# Altium project Arduino_Nano.PrjPcb
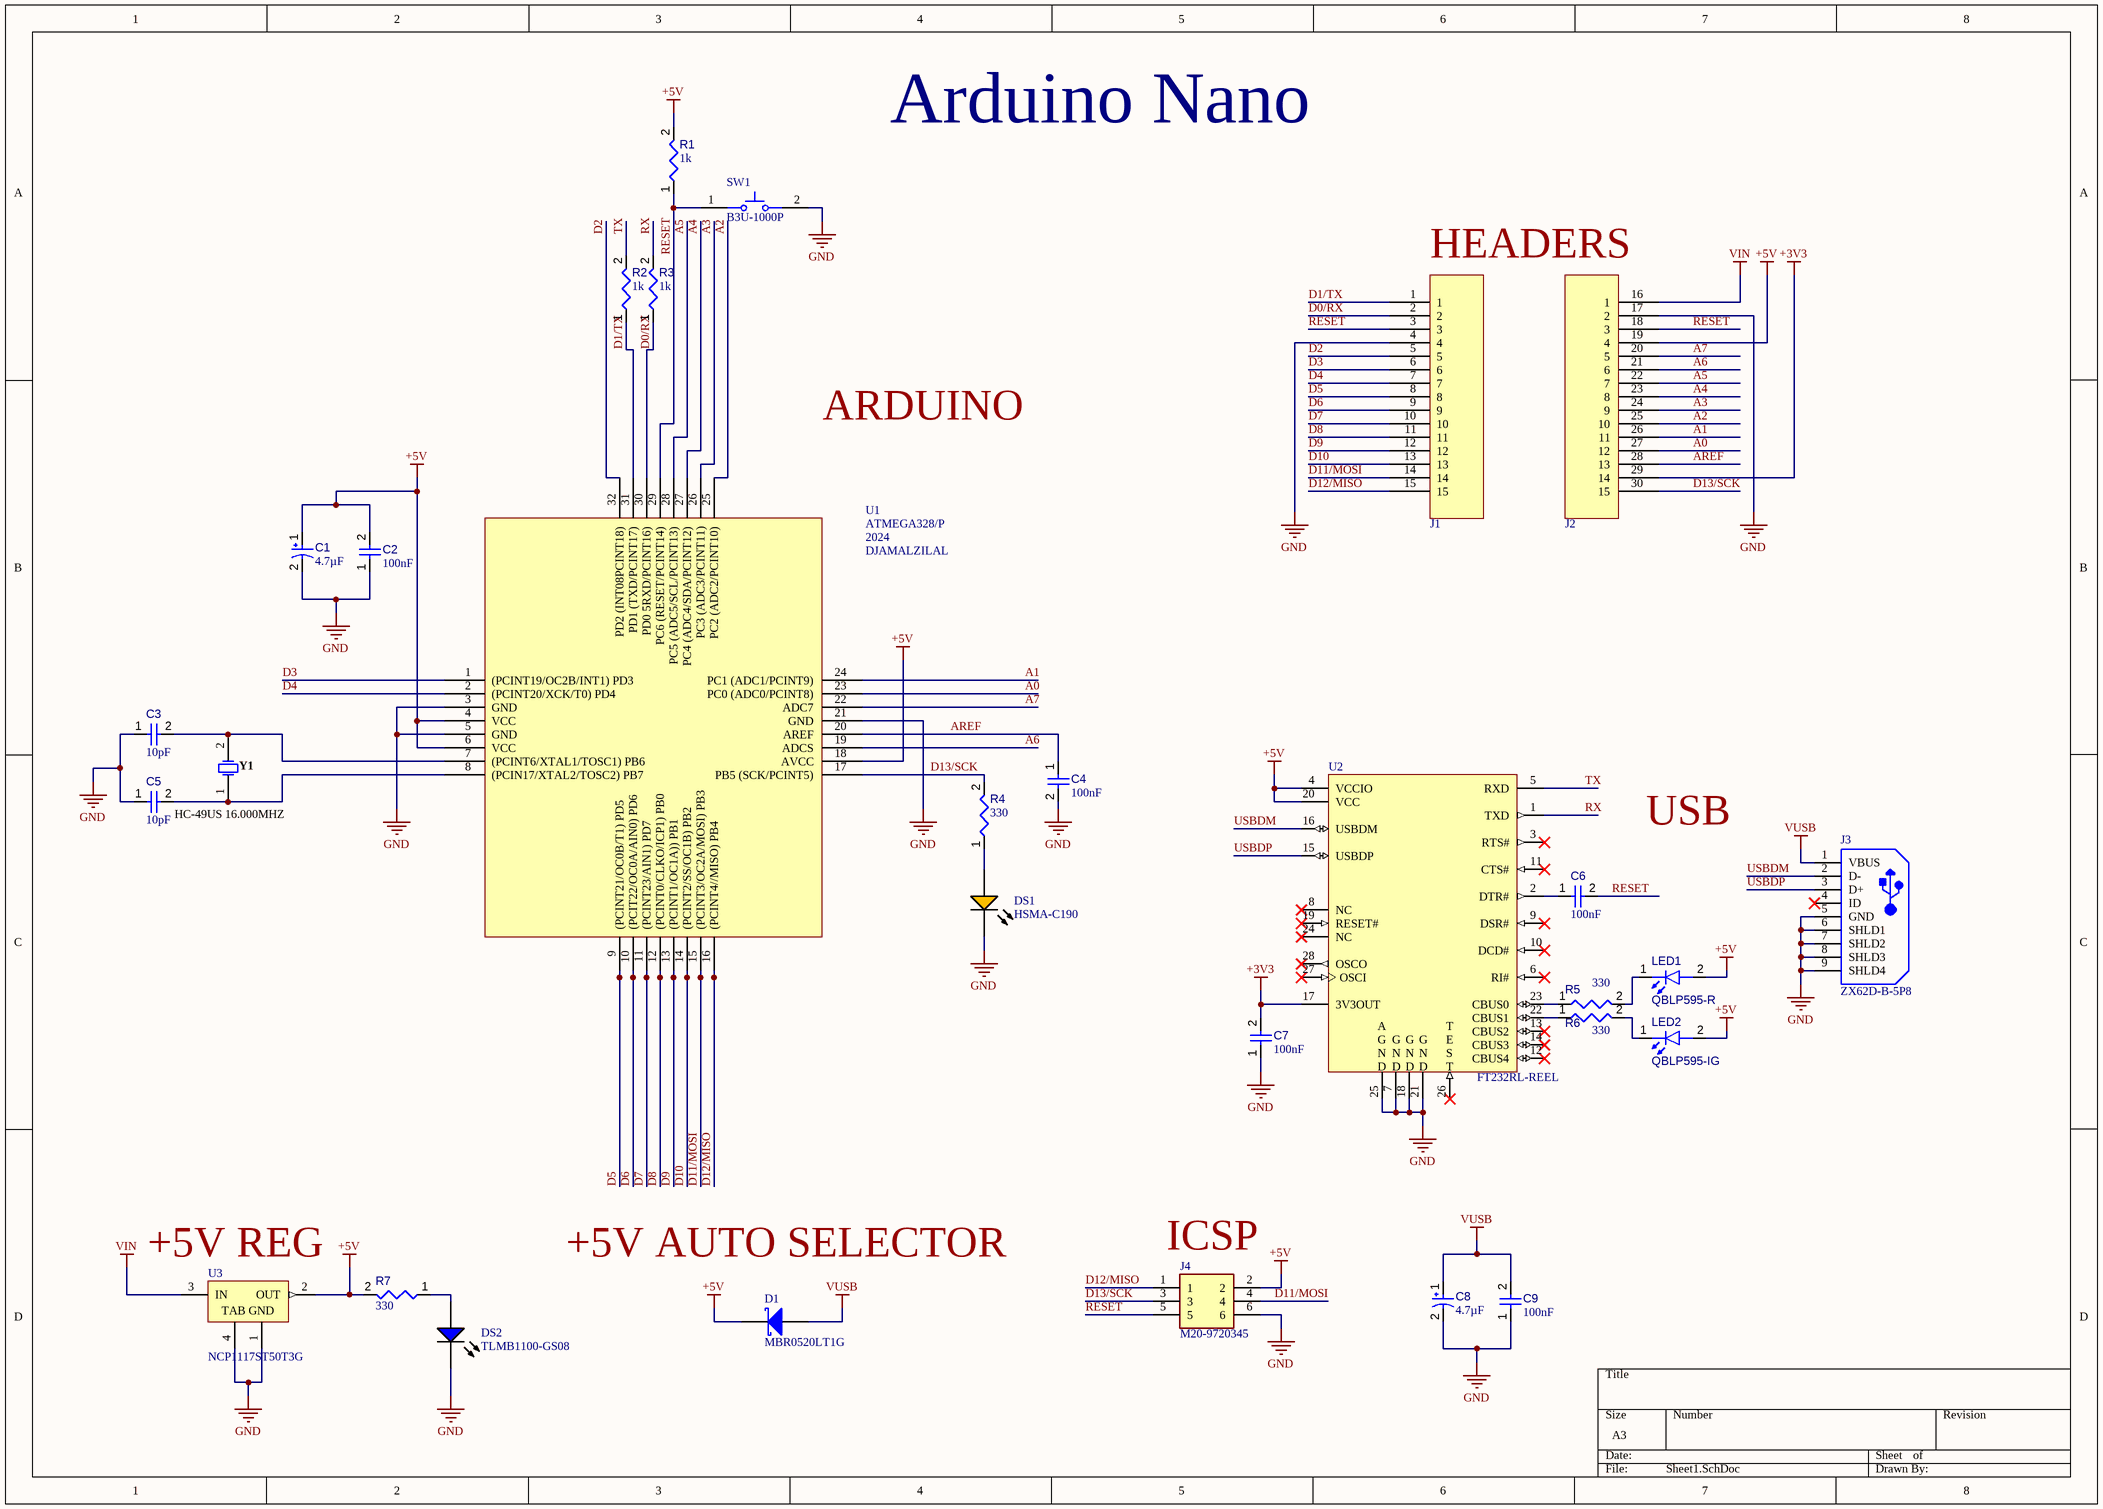
[diagram p0: Sheet1.SchDoc]
1 sheet, 30 parts. Net scope: global (net labels, ports and power ports of the same name join across sheets).
Board file: PCB1.PcbDoc

## Sheet Sheet1.SchDoc: ARDUINO NANO
size A3; Date: 03/03/2024; DrawnBy: ALTIUM DESIGNER; Engineer: DJAMAL ZILAL; Revision: REV01; SheetNumber: 1; SheetTotal: 1; Time: 14:40

### Parts
C1  value 4.7µF  [CAPPR55-200-1100X500X1200]  (hidden comment: ECA1HM4R7)
C2  value 100nF  [CAPC1005X56X25LL10T15]  (hidden comment: Capacitor 0.1 uF +/- 5% 16 V 0402)
C3  value 10pF  [CAPC1005X55X30LL05T10]  (hidden comment: Capacitor 10 pF +/- 0.25 pF 50 V 0402)
C4  value 100nF  [CAPC1005X56X25LL10T15]  (hidden comment: Capacitor 0.1 uF +/- 5% 16 V 0402)
C5  value 10pF  [CAPC1005X55X30LL05T10]  (hidden comment: Capacitor 10 pF +/- 0.25 pF 50 V 0402)
C6  value 100nF  [CAPC1005X56X25LL10T15]  (hidden comment: Capacitor 0.1 uF +/- 5% 16 V 0402)
C7  value 100nF  [CAPC1005X56X25LL10T15]  (hidden comment: Capacitor 0.1 uF +/- 5% 16 V 0402)
C8  value 4.7µF  [CAPPR55-200-1100X500X1200]  (hidden comment: ECA1HM4R7)
C9  value 100nF  [CAPC1005X56X25LL10T15]  (hidden comment: Capacitor 0.1 uF +/- 5% 16 V 0402)
D1  MBR0520LT1G  [ONSC-SOD-123-2-425-04_V]
DS1  HSMA-C190  [AVAG-HSMX-C190_V]
DS2  TLMB1100-GS08  [VISH-TLMX1100-2_V]
J1  both parts are inseparated  [PCBComponent_1]  (value not drawn)
J2  both parts are inseparated  [PCBComponent_1]  (value not drawn)
J3  ZX62D-B-5P8  [HIRO-ZX62D-B-5P8_V]
J4  M20-9720345  [HDRV6W64P254_2X3_762X508X864P]
LED1  QBLP595-R  [QTB-QBLP595_V]
LED2  QBLP595-IG  [QTB-QBLP595_V]
R1  value 1k  [RESC0402(1005)_L]  (hidden comment: 1KR2J)
R2  value 1k  [RESC0402(1005)_L]  (hidden comment: 1KR2J)
R3  value 1k  [RESC0402(1005)_L]  (hidden comment: 1KR2J)
R4  value 330  [RESC0402(1005)_L]  (hidden comment: 330R2J)
R5  value 330  [RESC0402(1005)_L]  (hidden comment: 330R2J)
R6  value 330  [RESC0402(1005)_L]  (hidden comment: 330R2J)
R7  value 330  [RESC0402(1005)_L]  (hidden comment: 330R2J)
SW1  B3U-1000P  [OMRON-B3U-1000_V]
U1  ATMEGA328/P  DATA CREATED: 2024  CREATED By: DJAMALZILAL  [ATMEGA328/P]
U2  FT232RL-REEL  [FTDI-SSOP-28_M]
U3  NCP1117ST50T3G  [ONSC-SOT-223-4-318H-01_A_V]
Y1  HC-49US 16.000MHZ  [JPY-HC-49US]

### Nets
+3V3: C7.2 J2.29(14) U2.17(3V3OUT)
+5V: C1.1 C2.2 D1.2(K) J2.19(4) J4.2 LED1.2(A) LED2.2(A) R1.2 R7.2 U1.4(VCC) U1.6(VCC) U1.18(AVCC) U2.4(VCCIO) U2.20(VCC) U3.2(OUT)
GND: C1.2 C2.1 C3.1 C4.2 C5.1 C7.1 C8.2 C9.1 DS1.2(K) DS2.2(K) J1.4 J2.17(2) J3.5(GND) J3.6(SHLD1) J3.7(SHLD2) J3.8(SHLD3) J3.9(SHLD4) J4.6 SW1.2 U1.3(GND) U1.5(GND) U1.21(GND) U2.7(GND) U2.18(GND) U2.21(GND) U2.25(AGND) U3.1(GND) U3.4(TAB)
VIN: J2.16(1) U3.3(IN)
VUSB: C8.1 C9.2 D1.1(A) J3.1(VBUS)
A0: J2.27(12) U1.23(PC0_(ADC0/PCINT8))
A1: J2.26(11) U1.24(PC1_(ADC1/PCINT9))
A2: J2.25(10) U1.25(PC2_(ADC2/PCINT10))
A3: J2.24(9) U1.26(PC3_(ADC3/PCINT11))
A4: J2.23(8) U1.27(PC4_(ADC4/SDA/PCINT12))
A5: J2.22(7) U1.28(PC5_(ADC5/SCL/PCINT13))
A6: J2.21(6) U1.19(ADCS)
A7: J2.20(5) U1.22(ADC7)
AREF: C4.1 J2.28(13) U1.20(AREF)
D0/RX: J1.2 R3.1 U1.30(PD0_5RXD/PCINT16))
D1/TX: J1.1 R2.1 U1.31(PD1_(TXD/PCINT17))
D2: J1.5 U1.32(PD2_(INT08PCINT18))
D3: J1.6 U1.1((PCINT19/OC2B/INT1)_PD3)
D4: J1.7 U1.2((PCINT20/XCK/T0)_PD4)
D5: J1.8 U1.9((PCINT21/OC0B/T1)_PD5)
D6: J1.9 U1.10((PCIT22/OC0A/AIN0)_PD6)
D7: J1.10 U1.11((PCINT23/AIN1)_PD7)
D8: J1.11 U1.12((PCINT0/CLKO/ICP1)_PB0)
D9: J1.12 U1.13((PCINT1/OC1A))_PB1)
D10: J1.13 U1.14((PCINT2/SS/OC1B)_PB2)
D11/MOSI: J1.14 J4.4 U1.15((PCINT3/OC2A/MOSI)_PB3)
D12/MISO: J1.15 J4.1 U1.16((PCINT4//MISO)_PB4)
D13/SCK: J2.30(15) J4.3 R4.2 U1.17(PB5_(SCK/PCINT5))
RESET: C6.2 J1.3 J2.18(3) J4.5 R1.1 SW1.1 U1.29(PC6_(RESET/PCINT14))
RX: R3.2 U2.1(TXD)
TX: R2.2 U2.5(RXD)
USBDM: J3.2(D-) U2.16(USBDM)
USBDP: J3.3(D+) U2.15(USBDP)
NetC3_2: C3.2 U1.7((PCINT6/XTAL1/TOSC1)_PB6) Y1.2
NetC5_2: C5.2 U1.8((PCIN17/XTAL2/TOSC2)_PB7) Y1.1
NetC6_1: C6.1 U2.2(DTR#)
NetDS1_1: DS1.1(A) R4.1
NetDS2_1: DS2.1(A) R7.1
NetLED1_1: LED1.1(K) R5.2
NetLED2_1: LED2.1(K) R6.2
NetR5_1: R5.1 U2.23(CBUS0)
NetR6_1: R6.1 U2.22(CBUS1)

Not connected (* = marked no-connect by the designer): J3 4(ID)*; U2 3(RTS#)* 6(RI#)* 8(NC)* 9(DSR#)* 10(DCD#)* 11(CTS#)* 12(CBUS4)* 13(CBUS2)* 14(CBUS3)* 19(RESET#)* 24(NC)* 26(TEST)* 27(OSCI)* 28(OSCO)*

### Notes on the sheet
- Arduino Nano
- HEADERS
- ARDUINO
- USB
- (near U3) +5V REG
- +5V AUTO SELECTOR
- (near J4) ICSP
- (in symbol CMP-015-00000-2) A / G / N / D; G / N / D; T / E / S / T

### Library data of the parts
C1 C8 = CMP-001-00033-7: Aluminum Electrolytic Capacitor, 4.7 uF, +/- 20%, 50 V, -40 to 85 degC, 2-Pin THD, RoHS, Bulk; Manufacturer: Panasonic; Ripple Current (AC): 45mA; Voltage Rating: 50V; Diameter: 5mm; Min Operating Temperature: -40°C; Lead Pitch: 2mm; Package Quantity: 200; Capacitor Type: Electrolytic; Ripple Current: 45mA; Datasheet Version: Rev. 05, 10/2016; Case/Package: Radial; Pins: 2; Manufacturer URL: http://www.panasonic.com/; RoHS Compliant: True; Package Description: 2-Pin Radial Lead, Dia 5 mm, Height 12 mm; Packaging: Bulk; Datasheet URL: https://industrial.panasonic.com/cdbs/www-data/pdf/RDF0000/ABA0000C1218.pdf; Mounting Technology: TH; Max Operating Temperature: 85°C; Package Reference: CAPPR55-200-1100X500X1200; Tolerance: 20%
C2 C4 C6 C7 C9 = CMP-001-00001-6: Chip Capacitor, 0.1 uF, +/- 5%, 16 V, 0402 (1005 Metric); Capacitor Type: Ceramic; Voltage Rating: 16V; Max Operating Temperature: 125°C; Min Operating Temperature: -55°C; Case/Package: 0402; Mounting Technology: SM; Pins: 2; Tolerance: 5%; RoHS Compliant: True
C3 C5 = CMP-001-00011-6: Chip Capacitor, 10 pF, +/- 0.25 pF, 50 V, 0402 (1005 Metric); Voltage Rating: 50V; Tolerance: 0.25%; Capacitor Type: Ceramic; Mounting Technology: SM; Pins: 2; Case/Package: 0402; Min Operating Temperature: -55°C; RoHS Compliant: True; Max Operating Temperature: 125°C
D1 = CMP-004-00003-2: Schottky Power Rectifier, 20 V, 5.5 A, -65 to 125 degC, 2-Pin SMD, RoHS, Tape and Reel; Manufacturer: ON Semiconductor; Forward Current: 500mA; Peak Reverse Current: 250uA; Elements: 1; Forward Voltage: 385mV; Max Surge Current: 5.5A; Max Operating Temperature: 125°C; Min Operating Temperature: -65°C; Mounting Technology: SM; Datasheet URL: http://www.onsemi.cn/pub_link/Collateral/MBR0520LT1-D.PDF; RoHS Compliant: True; Pins: 2; Package Quantity: 3000; Case/Package: SOD; Package Reference: SOD-123-2-425-04; Package Description: 2-Pin Surface Mount Device, Body 2.69 x 1.6 mm; Packaging: TapeandReel; Manufacturer URL: http://www.onsemi.com/; Datasheet Version: Rev. 6, 01/2012
DS1 = CMP-007-00011-2: LED Uni-Color Amber, 60 mW, 20 mA, -40 to 85 degC, 2-Pin SMD, RoHS, Tape and Reel; Manufacturer: Avago; Forward Current: 20mA; Colour: Orange; Luminous Intensity: 90mcd; Lens Style: Diffused; Power: 60mW; Nominal Vf: 1.9V; Viewing Angle: 170degrees; Datasheet Version: Sep-10; Mounting Technology: SM; Case/Package: 0603; RoHS Compliant: True; Pins: 2; Packaging: TapeandReel; Package Reference: HSMX-C190; Manufacturer URL: http://www.avagotech.com/; Package Quantity: 4000; Min Operating Temperature: -40°C; Datasheet URL: http://docs.avagotech.com/docs/AV02-0112EN; Max Operating Temperature: 85°C; Forward Voltage: 1.9V; Package Description: 2-Pin Surface Mount Device, Body 1.6 x 0.8 mm, Height 0.9 mm; Illumination Colour: Orange
DS2 = CMP-007-00028-2: Blue LED, 10 mA, 3.9 V, -40 to 100 degC, 2-Pin SMD (0603), RoHS, Tape and Reel; Manufacturer: Vishay Semiconductor; Forward Voltage: 3.9V; Viewing Angle: 160degrees; Power: 68mW; Forward Current: 10mA; Lens Style: Diffused; Luminous Intensity: 5mcd; Case/Package: 0603; Datasheet URL: http://download.siliconexpert.com/pdfs/2016/8/7/12/43/26/667/vsh_/manual/379263299541529tlmb1100.pdf; Illumination Colour: Blue; Datasheet Version: Rev. 2.7, 03/2016; Manufacturer URL: http://www.vishay.com/; Package Reference: 0603; Min Operating Temperature: -40°C; Packaging: TapeandReel; RoHS Compliant: True; Nominal Vf: 3.9V; Mounting Technology: SM; Pins: 2; Package Description: 2-Pin Surface Mount Device, Body 1.6 x 0.8 mm; Colour: Blue; Package Quantity: 3000; Max Operating Temperature: 100°C
J1 J2 = Header 15
J3 = CMP-002-00043-2: Right Angle Receptacle Connector, Micro USB, 5 Position, Height 2.65 mm, -30 to 85 degC, RoHS, Tape and Reel; Manufacturer: Hirose Electric; Gender: Male; Rows: 1; Current Rating: 1A; Max Operating Temperature: 85°C; Package Quantity: 2000; Connector Type: USB; Datasheet Version: Aug-16; Contact Material: Copper; Packaging: TapeandReel; Package URL: https://www.hirose.com/product/en/download_file/key_name/ZX62D-B-5P8/category/Drawing%20(2D)/doc_file_id/36535/?file_category_id=6&item_id=02420034000&is_series=; Min Operating Temperature: -30°C; Case/Package: ZX62D-B-5P8; Package Reference: ZX62D-B-5P8; Pins: 5; Mounting Technology: SM; Package Description: USB Connector, 5 Position Surface Mount, Length 8 mm, Height 2.65 mm; Housing Material: Plastic; Datasheet URL: https://www.hirose.com/product/en/download_file/key_name/ZX62D-B-5P8/category/Catalog/doc_file_id/31704/?file_category_id=5&item_id=02420034000&is_series=; Contact Plating: Gold; Lead Pitch: 0.65mm; RoHS Compliant: True; Manufacturer URL: https://www.hirose.com
J4 = M20-9720345: Connector; Manufacturer_Name: Harwin; Datasheet Link: https://cdn.harwin.com/pdfs/M20-972.pdf; Height: 8.64mm; Manufacturer_Part_Number: M20-9720345; Mouser Part Number: 855-M20-9720345; Mouser Price/Stock: https://www.mouser.co.uk/ProductDetail/Harwin/M20-9720345?qs=vF78I%252BjhbY8b2N4EUBH%2Fyg%3D%3D
LED1 = CMP-007-00040-3: Chip LED 0402, Red, 0.02 A, 2.0 to 2.5 V, -40 to 80 degC, 2-Pin SMD, RoHS, Tape and Reel; Colour: Red; RoHS Compliant: Yes; Case/Package: 0402; Pins: 2; Mounting Technology: SMT
LED2 = CMP-007-00041-3: Chip LED 0402, Green, 0.02 A, 3.1 to 3.7 V, -40 to 80 degC, 2-Pin SMD, RoHS, Tape and Reel; Case/Package: 0402; Colour: Green; Mounting Technology: SMT; Pins: 2; RoHS Compliant: Yes
R1-R3 = CMP-009-00075-2: 1K 0.063W 5% 0402 (1005 Metric)  SMD; Power: 63mW; Pins: 2; Mounting Technology: SMT; Case/Package: 0402; Tolerance: 5%
R4-R7 = CMP-009-00095-2: 330R 0.063W 5% 0402 (1005 Metric)  SMD; Power: 63mW; Tolerance: 5%; Mounting Technology: SMT; Case/Package: 0402; Pins: 2
SW1 = CMP-011-00000-2: Tactile Switch, SPST-NO, 0.05 A, 12 V, -25 to 70 degC, 2-Pin SMD, RoHS, Tape and Reel; Manufacturer: Omron Electronic Components; IP Rating: IP40; Current Rating: 50mA; Max Contact Resistance: 100mohm; Operating Force: 153gf; Throw Configuration: SPST; Resistance: 0.1Ohm; Max Voltage Rating (DC): 12V; Contact Material: Silver; Max Current Rating: 50mA; Datasheet URL: http://www.omron.com/ecb/products/pdf/en-b3u.pdf; Mounting Technology: SM; Case/Package: B3U-1000; Packaging: TapeandReel; Package Reference: B3U-1000; Manufacturer URL: http://www.omron.com/; Datasheet Version: Jan-15; RoHS Compliant: True; Max Operating Temperature: 70°C; Contact Current Rating: 50mA; Package Quantity: 3500; Package Description: 2-Pin Surface Mount Device, Body 3 x 2.5 mm; Voltage Rating (DC): 12V; Min Operating Temperature: -25°C; Voltage Rating: 12V
U1 = ATMEGA328/P: OrganizationName: Djamal_Organization; ComponentLink1Description: DATASHEET; ComponentLink1URL: https://ww1.microchip.com/downloads/en/DeviceDoc/Atmel-7810-Automotive-Microcontrollers-ATmega328P_Datasheet.pdf; DATASHEET: https://ww1.microchip.com/downloads/en/DeviceDoc/Atmel-7810-Automotive-Microcontrollers-ATmega328P_Datasheet.pdf
U2 = CMP-015-00000-2: USB UART IC, -0.5 to 6 V, 24 mA, -40 to 85 degC, 28-Pin SSOP, RoHS, Tape and Reel; Manufacturer: Future Technology Devices International (FTDI); Data Rate: 3Mbps; Channels: 1; Min Supply Voltage: 3.3V; Nominal Supply Voltage: 5V; Max Supply Voltage: 5.25V; Datasheet Version: Rev. 1.04, 02/2006; RoHS Compliant: True; Package Quantity: 2000; Manufacturer URL: http://www.ftdichip.com/; Interface: UART; Packaging: TapeandReel; Case/Package: SSOP; Datasheet URL: http://datasheet.octopart.com/FT232RL-FTDI-datasheet-120501.pdf; Min Operating Temperature: -40°C; Max Operating Temperature: 85°C; Pins: 16
U3 = CMP-019-00031-3: Low-Dropout Positive Fixed Voltage Regulator, 1 A, 5 V Vout, 0 to 125 degC, 4-Pin SOT-223, Pb-Free, Tape and Reel; Manufacturer: ON Semiconductor; Current Rating: -600A; Output Voltage: 5V; Max Ouput Current: 1A; Max Input Voltage: 20V; Outputs: 1; Dropout Voltage: 1.2V; Min Input Voltage: 3.5V; Datasheet Version: Rev. 26, 08/2013; Package Quantity: 4000; Package Description: 4-Pin Small Outline Transistor, Body 6.5 x 3.5 mm, Pitch 2.3 mm; RoHS Compliant: True; Max Operating Temperature: 125°C; Nominal Output Voltage: 5V; Datasheet URL: https://datasheet.ciiva.com/28483/1748260-28483320.pdf; Min Operating Temperature: 0°C; Manufacturer URL: http://www.onsemi.com/; Output Current: 1A; Pins: 3; Mounting Technology: SM; Package Reference: SOT-223-4-318H-01_A; Case/Package: TO-261-4; Packaging: TapeandReel
Y1 = CMP-003-00005-2: Crystal, 16 MHz, +/- 30 ppm, 18 pF, -20 to 70 degC, 2-Pin THD; Manufacturer: Jing peng yuan; Frequency: 16MHz; Package Reference: HC-49US; Case/Package: HC-49US; RoHS Compliant: Unknown; Mounting Technology: TH; Package Description: 2-Pin Throug Hole Device, Body 11.05 x 4.65 mm, Pitch 4.9 mm; Datasheet URL: https://statics3.seeedstudio.com/images/opl/datasheet/306010014.pdf; Datasheet Version: May-15